# Altium schematic sheet FPGA Bank 1.SchDoc
size A4
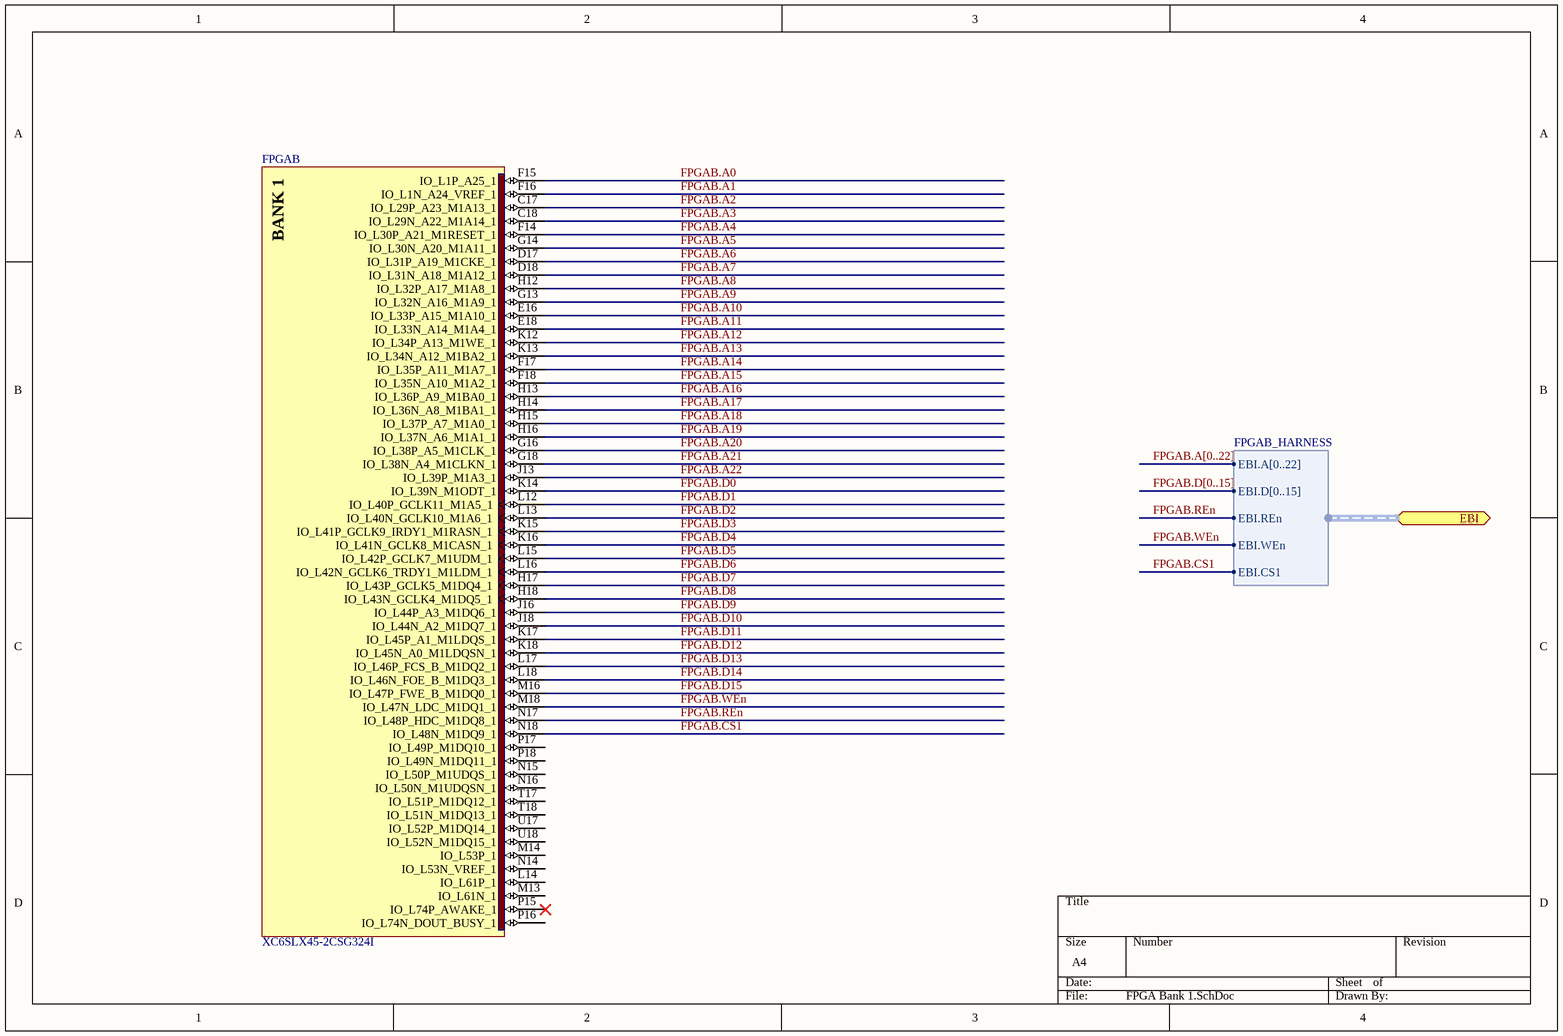
[diagram p0: FPGA Bank 1.SchDoc]

## Parts
FPGA  XC6SLX45-2CSG324I  [CSG324]  (part B of 8)

## Ports
EBI (harness FPGAB_HARNESS)

## Harnesses
FPGAB_HARNESS: EBI.A[0..22], EBI.D[0..15], EBI.REn, EBI.WEn, EBI.CS1

## Nets
FPGAB.A0: FPGA.F15(IO_L1P_A25_1)
FPGAB.A1: FPGA.F16(IO_L1N_A24_VREF_1)
FPGAB.A2: FPGA.C17(IO_L29P_A23_M1A13_1)
FPGAB.A3: FPGA.C18(IO_L29N_A22_M1A14_1)
FPGAB.A4: FPGA.F14(IO_L30P_A21_M1RESET_1)
FPGAB.A5: FPGA.G14(IO_L30N_A20_M1A11_1)
FPGAB.A6: FPGA.D17(IO_L31P_A19_M1CKE_1)
FPGAB.A7: FPGA.D18(IO_L31N_A18_M1A12_1)
FPGAB.A8: FPGA.H12(IO_L32P_A17_M1A8_1)
FPGAB.A9: FPGA.G13(IO_L32N_A16_M1A9_1)
FPGAB.A10: FPGA.E16(IO_L33P_A15_M1A10_1)
FPGAB.A11: FPGA.E18(IO_L33N_A14_M1A4_1)
FPGAB.A12: FPGA.K12(IO_L34P_A13_M1WE_1)
FPGAB.A13: FPGA.K13(IO_L34N_A12_M1BA2_1)
FPGAB.A14: FPGA.F17(IO_L35P_A11_M1A7_1)
FPGAB.A15: FPGA.F18(IO_L35N_A10_M1A2_1)
FPGAB.A16: FPGA.H13(IO_L36P_A9_M1BA0_1)
FPGAB.A17: FPGA.H14(IO_L36N_A8_M1BA1_1)
FPGAB.A18: FPGA.H15(IO_L37P_A7_M1A0_1)
FPGAB.A19: FPGA.H16(IO_L37N_A6_M1A1_1)
FPGAB.A20: FPGA.G16(IO_L38P_A5_M1CLK_1)
FPGAB.A21: FPGA.G18(IO_L38N_A4_M1CLKN_1)
FPGAB.A22: FPGA.J13(IO_L39P_M1A3_1)
FPGAB.CS1: FPGA.N18(IO_L48N_M1DQ9_1) ; port EBI.EBI.CS1
FPGAB.D0: FPGA.K14(IO_L39N_M1ODT_1)
FPGAB.D1: FPGA.L12(IO_L40P_GCLK11_M1A5_1)
FPGAB.D2: FPGA.L13(IO_L40N_GCLK10_M1A6_1)
FPGAB.D3: FPGA.K15(IO_L41P_GCLK9_IRDY1_M1RASN_1)
FPGAB.D4: FPGA.K16(IO_L41N_GCLK8_M1CASN_1)
FPGAB.D5: FPGA.L15(IO_L42P_GCLK7_M1UDM_1)
FPGAB.D6: FPGA.L16(IO_L42N_GCLK6_TRDY1_M1LDM_1)
FPGAB.D7: FPGA.H17(IO_L43P_GCLK5_M1DQ4_1)
FPGAB.D8: FPGA.H18(IO_L43N_GCLK4_M1DQ5_1)
FPGAB.D9: FPGA.J16(IO_L44P_A3_M1DQ6_1)
FPGAB.D10: FPGA.J18(IO_L44N_A2_M1DQ7_1)
FPGAB.D11: FPGA.K17(IO_L45P_A1_M1LDQS_1)
FPGAB.D12: FPGA.K18(IO_L45N_A0_M1LDQSN_1)
FPGAB.D13: FPGA.L17(IO_L46P_FCS_B_M1DQ2_1)
FPGAB.D14: FPGA.L18(IO_L46N_FOE_B_M1DQ3_1)
FPGAB.D15: FPGA.M16(IO_L47P_FWE_B_M1DQ0_1)
FPGAB.REn: FPGA.N17(IO_L48P_HDC_M1DQ8_1) ; port EBI.EBI.REn
FPGAB.WEn: FPGA.M18(IO_L47N_LDC_M1DQ1_1) ; port EBI.EBI.WEn

Not connected (* = marked no-connect by the designer): FPGA L14(IO_L61P_1) M13(IO_L61N_1) M14(IO_L53P_1) N14(IO_L53N_VREF_1) N15(IO_L50P_M1UDQS_1) N16(IO_L50N_M1UDQSN_1) P15(IO_L74P_AWAKE_1)* P16(IO_L74N_DOUT_BUSY_1) P17(IO_L49P_M1DQ10_1) P18(IO_L49N_M1DQ11_1) T17(IO_L51P_M1DQ12_1) T18(IO_L51N_M1DQ13_1) U17(IO_L52P_M1DQ14_1) U18(IO_L52N_M1DQ15_1)

## Buses and harness runs
bus FPGAB.A[0..22]
bus FPGAB.D[0..15]

## Notes on the sheet
- (in symbol XC6SLX45-2CSG324I, part B) BANK 1

## Library data of the parts
FPGA = XC6SLX45-2CSG324I: Spartan-6 LX 1.2V FPGA, 218 User I/Os, 324-Ball Chip-Scale BGA (0.8mm Pitch), Speed Grade 2, Industrial Grade, Pb-Free; Published: 17-Nov-2009; DatasheetVersion: ver1.6, Nov-2010; PackageVersion: ver1.1, Nov-2009; PackageReference: CSG324; Publisher: Altium Limited; PackageDescription: 324-Ball Chip-Scale BGA (CSG324) Package, 0.8 mm Pitch; Supplier 1: Digi-Key; Supplier Part Number 1: XC6SLX45-2CSG324I-ND; Code_JEDEC: MO-275-KKAC-1; ComponentLink1Description: Manufacturer Link; ComponentLink1URL: http://www.xilinx.com; ComponentLink2Description: Spartan-6 Datasheet; ComponentLink2URL: http://www.xilinx.com/support/documentation/data_sheets/ds160.pdf; ComponentLink3Description: Spartan-6 Documents; ComponentLink3URL: http://www.xilinx.com/support/documentation/spartan-6.htm; ComponentLink4Description: Xilinx.com Home; ComponentLink4URL: http://www.xilinx.com